# EAGLE design EEPromCap (EAGLE 7.4.0)
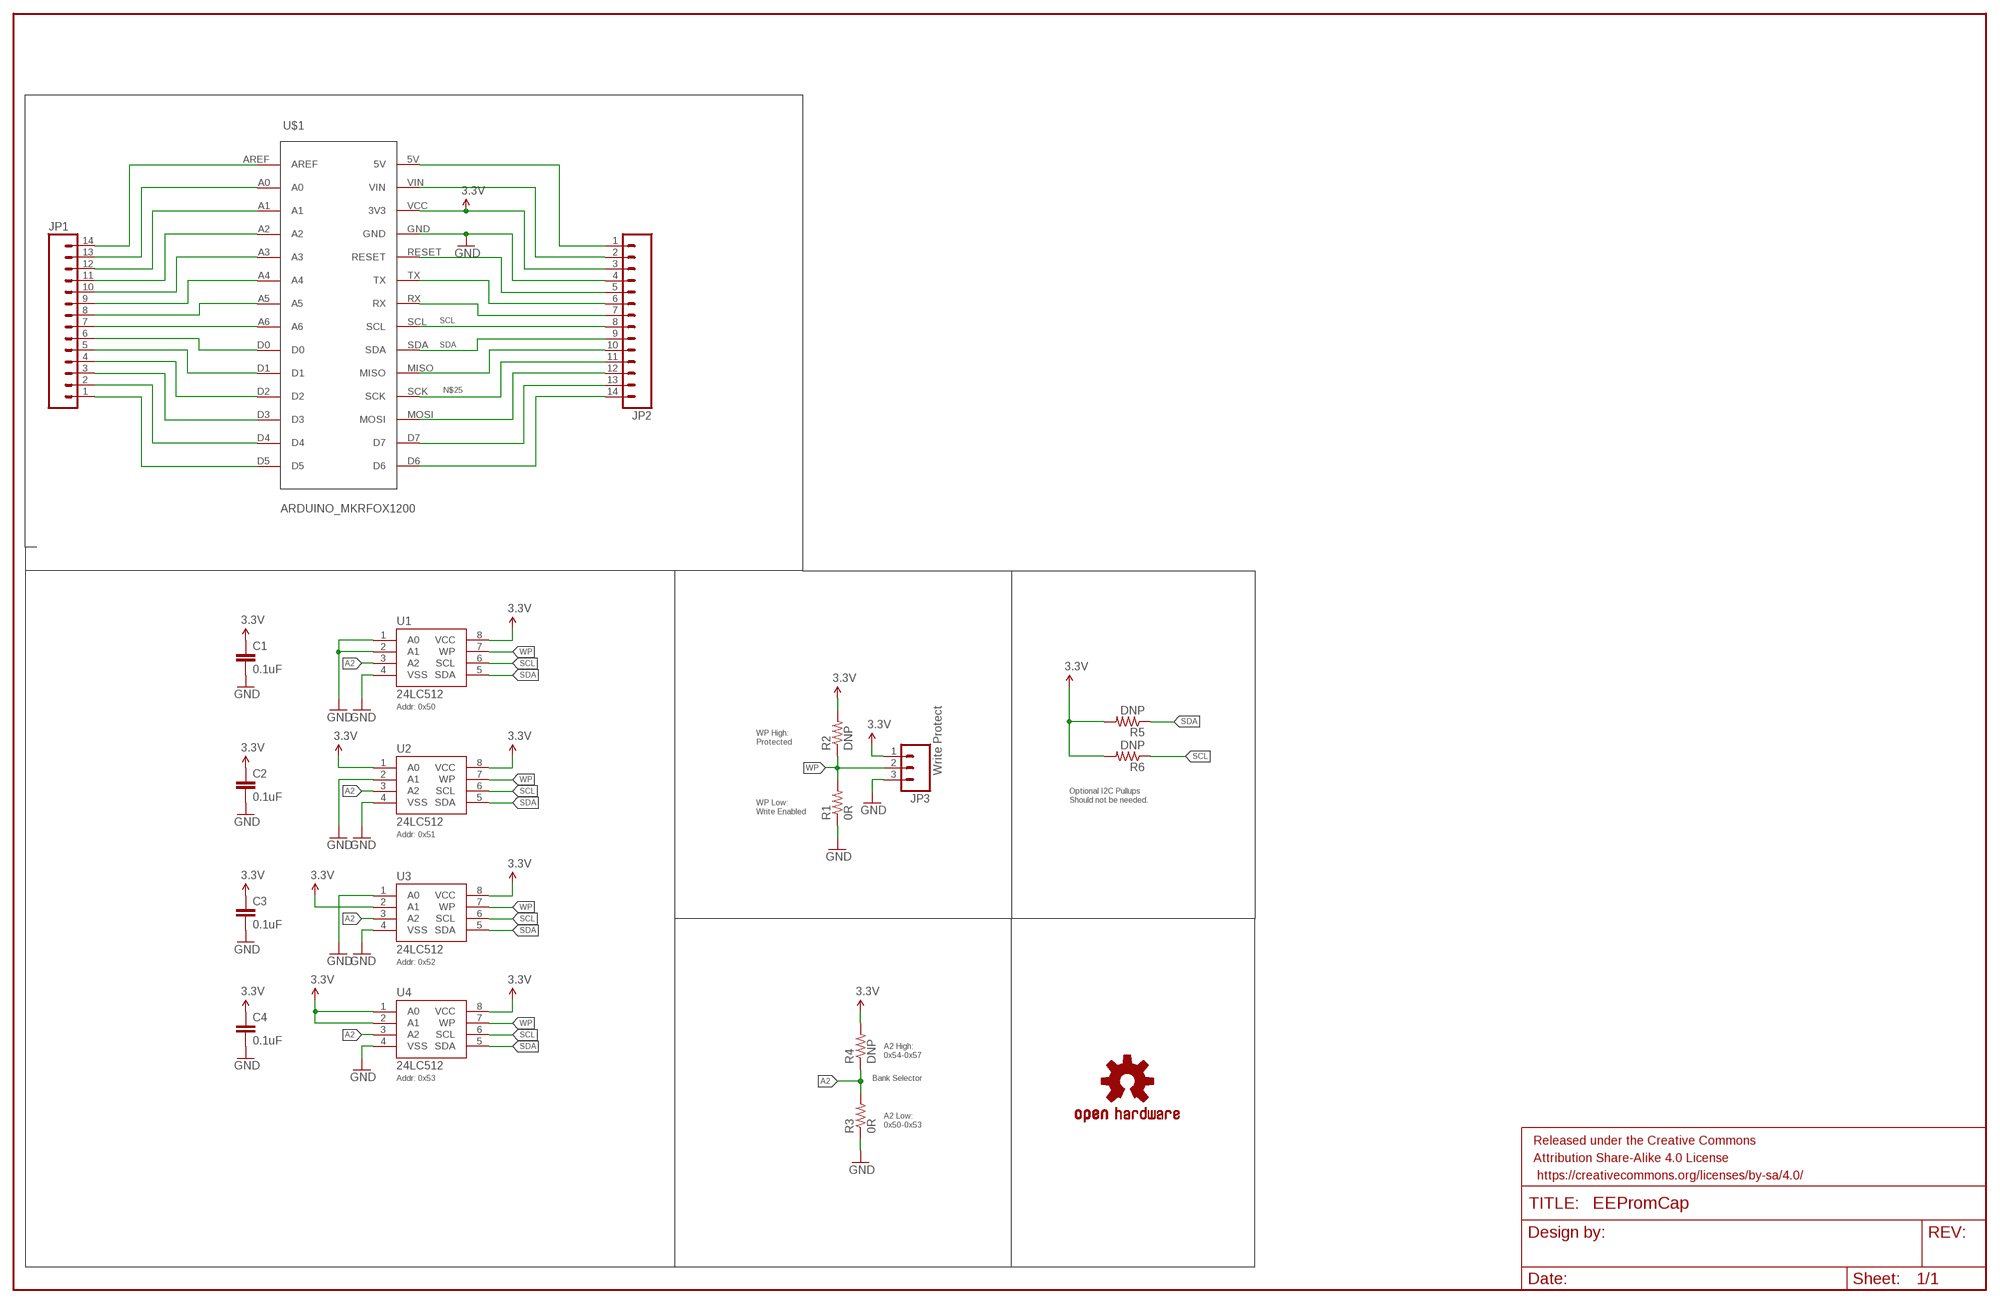
[diagram p0: schematic, sheet 1]

## Parts
C1  0.1uF  CAP1206  [1206]
C2  0.1uF  CAP1206  [1206]
C3  0.1uF  CAP1206  [1206]
C4  0.1uF  CAP1206  [1206]
FRAME1  FRAME-LEDGER  [CREATIVE_COMMONS]
JP1  M14  [1X14]
JP2  M14  [1X14]
JP3  Write Protect  M03PTH  [1X03]
LOGO2  OSHW-LOGOM  [OSHW-LOGO-M]
R1  0R  RESISTOR1206  [1206]
R2  DNP  RESISTOR1206  [1206]
R3  0R  RESISTOR1206  [1206]
R4  DNP  RESISTOR1206  [1206]
R5  DNP  RESISTOR0805-RES  [0805]
R6  DNP  RESISTOR0805-RES  [0805]
U1  24LC512  EEPROM-I2CSMD  [SO08]
U2  24LC512  EEPROM-I2CSMD  [SO08]
U3  24LC512  EEPROM-I2CSMD  [SO08]
U4  24LC512  EEPROM-I2CSMD  [SO08]
U$1  ARDUINO_MKRFOX1200  [ARDUINO_MKRFOX1200]

## Nets
3.3V: C1.1 C2.1 C3.1 C4.1 JP2.3 JP3.1 R2.2 R4.2 R5.2 R6.2 U1.8(VCC) U2.1(A0) U2.8(VCC) U3.2(A1) U3.8(VCC) U4.1(A0) U4.2(A1) U4.8(VCC) U$1.VCC(3V3)
A2: R3.2 R4.1 U1.3(A2) U2.3(A2) U3.3(A2) U4.3(A2)
GND: C1.2 C2.2 C3.2 C4.2 JP2.4 JP3.3 R1.1 R3.1 U1.1(A0) U1.2(A1) U1.4(VSS) U2.2(A1) U2.4(VSS) U3.1(A0) U3.4(VSS) U4.4(VSS) U$1.GND
N$1: JP1.14 U$1.AREF
N$2: JP1.13 U$1.A0
N$3: JP1.12 U$1.A1
N$4: JP1.11 U$1.A2
N$5: JP1.10 U$1.A3
N$6: JP1.9 U$1.A4
N$7: JP1.8 U$1.A5
N$8: JP1.7 U$1.A6
N$9: JP1.6 U$1.D0
N$10: JP1.5 U$1.D1
N$11: JP1.4 U$1.D2
N$12: JP1.3 U$1.D3
N$13: JP1.2 U$1.D4
N$14: JP1.1 U$1.D5
N$15: JP2.1 U$1.5V
N$16: JP2.2 U$1.VIN
N$19: JP2.5 U$1.RESET
N$20: JP2.6 U$1.TX
N$21: JP2.7 U$1.RX
N$24: JP2.10 U$1.MISO
N$25: JP2.11 U$1.SCK
N$26: JP2.12 U$1.MOSI
N$27: JP2.13 U$1.D7
N$28: JP2.14 U$1.D6
SCL: JP2.8 R6.1 U1.6(SCL) U2.6(SCL) U3.6(SCL) U4.6(SCL) U$1.SCL
SDA: JP2.9 R5.1 U1.5(SDA) U2.5(SDA) U3.5(SDA) U4.5(SDA) U$1.SDA
WP: JP3.2 R1.2 R2.1 U1.7(WP) U2.7(WP) U3.7(WP) U4.7(WP)

## Notes on the sheet
- Addr: 0x50
- WP High:
  Protected
- Optional I2C Pullups
  Should not be needed.
- WP Low:
  Write Enabled
- Addr: 0x51
- Addr: 0x52
- A2 High:
  0x54-0x57
- Addr: 0x53 | Bank Selector
- A2 Low:
  0x50-0x53

## Library data of the parts
C1-C4 = SparkFun-Capacitors:CAP: Capacitor Standard 0603 ceramic capacitor, and 0.1" leaded capacitor.
FRAME1 = SparkFun-Aesthetics:FRAME-LEDGER: Schematic Frame Standard 11x14 US Ledger frame
JP1 JP2 = SparkFun-Connectors:M14: Header 14 Standard 14-pin 0.1" header. Use with straight break away headers (SKU : PRT-00116), right angle break away headers (PRT-00553), swiss pins (PRT-00743), machine pins (PRT-00117), and female headers (PRT-00115).
JP3 = SparkFun-Connectors:M03: Header 3 Standard 3-pin 0.1" header. Use with straight break away headers (SKU : PRT-00116), right angle break away headers (PRT-00553), swiss pins (PRT-00743), machine pins (PRT-00117), and female headers (PRT-00115). Molex polarized connector foot print use with SKU : PRT-08232 with associated crimp pins and housings.
LOGO2 = SparkFun-Aesthetics:OSHW-LOGO: Open Source Hardware Logo This logo indicates the piece of hardware it is found on incorporates a OSHW license and/or adheres to the definition of open source hardware found here: http://freedomdefined.org/OSHW
R1-R6 = SparkFun-Resistors:RESISTOR: Resistor Basic schematic elements and footprints for 0603, 1206, and PTH resistors.
U1-U4 = SparkFun-DigitalIC:EEPROM-I2C: I2C EEPROM chips, 24LC256 (and others)
U$1 = Arduino:ARDUINO_MKRFOX1200

## Board
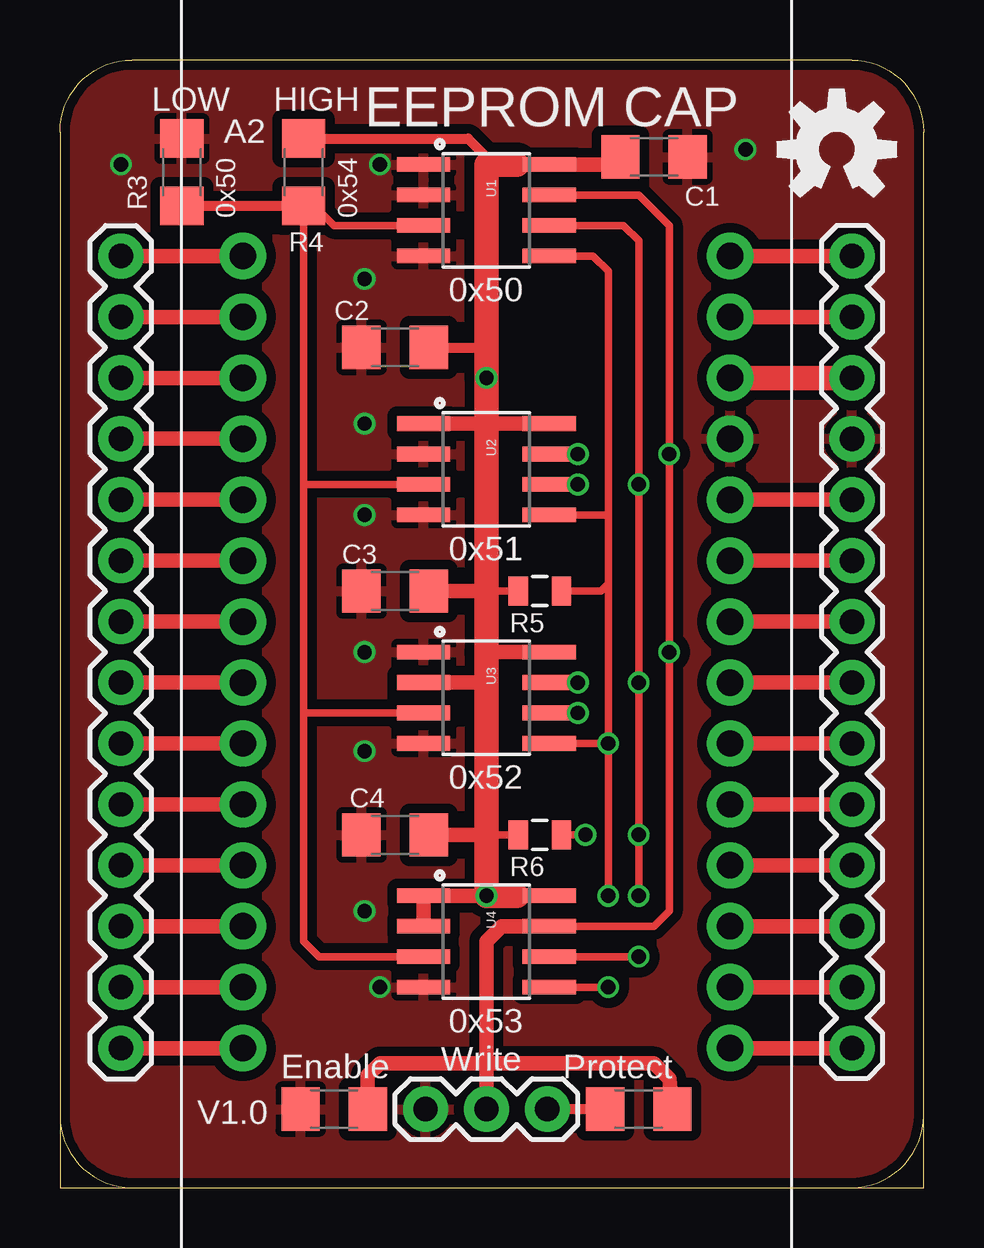
[diagram p1: board, top side]
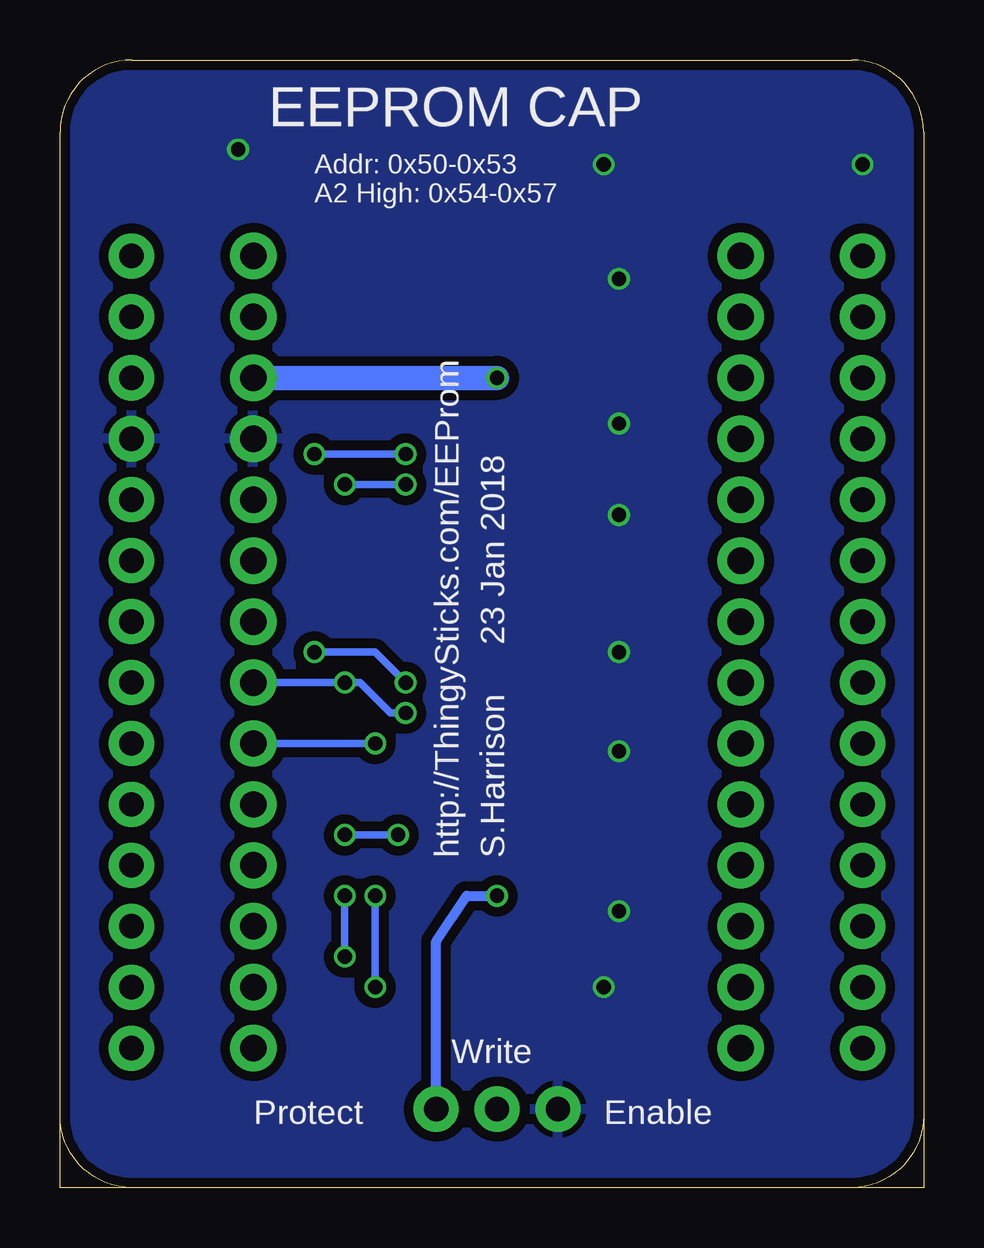
[diagram p2: board, bottom side, seen from below]

Size 36 x 47 mm. Coordinates in mm from the lower left corner, seen from the top.
Outline: 3,0 0,0 0,3
Outline: 3,0 33,0
Outline: 33,0 36,0 36,3
Outline: 36,3 36,44 arc90 33,47 3,47 arc90 0,44 0,3
Outline: 0,3 arc90 3,0
Outline: 33,0 arc90 36,3
Copper layers (1*16): Top 0.035mm / dielectric 1.5mm / Bottom 0.035mm
Design rules "dirt_cheap_dirty_boards.v1": minimum track width 5mil, minimum drill 12mil, track to track 5mil, track to pad 5mil, pad to pad 5mil, via to via 5mil, smd to smd 0mil, copper to edge 10mil, drill to drill 10mil, minimum pad ring 10mil, minimum via ring 6mil, stop-mask expansion 2mil, vias tented up to drill 25mil, thermal gap 10mil

### Footprints (pad centres in the part's own frame; a part is rotated, then mirrored left to right if it is on the bottom)
1206 = smd 1.6 x 1.8: 1 -1.4,0; 2 1.4,0
1X14 = drill 1.016 pad 1.88: 1 0,0; 2 2.54,0; 3 5.08,0; 4 7.62,0; 5 10.16,0; 6 12.7,0; 7 15.24,0; 8 17.78,0; 9 20.32,0; 10 22.86,0; 11 25.4,0; 12 27.94,0; 13 30.48,0; 14 33.02,0
1X03 = drill 1.016 pad 1.88: 1 0,0; 2 2.54,0; 3 5.08,0
0805 = smd 0.8 x 1.2: 1 -0.9,0; 2 0.9,0
SO08 = smd 0.61 x 2.21: 1 -1.905,-2.616; 2 -0.635,-2.616; 3 0.635,-2.616; 4 1.905,-2.616; 5 1.905,2.616; 6 0.635,2.616; 7 -0.635,2.616; 8 -1.905,2.616
ARDUINO_MKRFOX1200 = drill 1.1 pad 1.93: 5V 22.86,45.72; A0 2.54,43.18; A1 2.54,40.64; A2 2.54,38.1; A3 2.54,35.56; A4 2.54,33.02; A5 2.54,30.48; A6 2.54,27.94; AREF 2.54,45.72; D0 2.54,25.4; D1 2.54,22.86; D2 2.54,20.32; D3 2.54,17.78; D4 2.54,15.24; D5 2.54,12.7; D6 22.86,12.7; D7 22.86,15.24; GND 22.86,38.1; MISO 22.86,22.86; MOSI 22.86,17.78; RESET 22.86,35.56; RX 22.86,30.48; SCK 22.86,20.32; SCL 22.86,27.94; SDA 22.86,25.4; TX 22.86,33.02; VCC 22.86,40.64; VIN 22.86,43.18

### Placement (x,y rotation side)
C1  24.77,42.96 0 top
C2  13.97,35.02 180 top
C3  13.97,24.86 180 top
C4  13.97,14.7 180 top
FRAME1  -9.53,-88.81 0 top  (outside the outline)
JP1  2.54,5.81 90 top
JP2  33.02,38.83 270 top
JP3  20.32,3.27 180 top
LOGO2  32.38,43.27 0 top
R1  11.43,3.27 0 top
R2  24.13,3.27 180 top
R3  5.08,42.32 270 top
R4  10.16,42.32 90 top
R5  20,24.86 180 top
R6  20,14.7 180 top
U1  17.78,40.73 270 top
U2  17.78,29.94 270 top
U3  17.78,20.41 270 top
U4  17.78,10.26 270 top
U$1  5.08,-6.89 0 top

### Tracks (layer width: path | path; a pad name or v marks a point on that pad's centre or on a via)
3.3V  (via drill 0.6)
  Top 0.305: R6.2 17.78,14.7 | R5.2 18.1,24.86 17.78,24.54
  Top 0.406: R4.2 17.02,43.72 17.78,42.96 17.78,42.64 | C2.1 17.78,35.02 | R2.2 JP3.1
  Top 0.61: 19.05,42.64 U1.8 22.73,42.64 C1.1 | 19.05,12.16 U4.8 | U2.8 17.78,31.84 U2.1 | U3.8 17.78,22.32 | C3.1 17.78,24.86 | U3.2 17.78,21.05 | C4.1 17.78,14.7 | v17.78,12.16 U4.1 U4.2
  Top 1.016: JP2.3 U$1.VCC | 19.05,42.64 17.78,42.64 17.78,35.02 v17.78,33.75 17.78,31.84 17.78,24.86 17.78,24.54 17.78,22.32 17.78,21.05 17.78,14.7 v17.78,12.16 19.05,12.16
  Bottom 0.406: JP3.1 20.32,10.26 19.05,12.16 v17.78,12.16
  Bottom 1.016: U$1.VCC v17.78,33.75
A2
  Top 0.305: 10.16,41.37 11.43,40.1 U1.3 | U4.3 10.79,9.62 10.16,10.26 10.16,19.78 | 10.16,19.78 10.16,29.3 | 10.16,29.3 R4.1 | U2.3 10.16,29.3 | U3.3 10.16,19.78
  Top 0.406: R3.2 R4.1 10.16,41.37
GND  (via drill 0.6)
  other vias: 13.34,8.35 12.7,18.19 12.7,22.32 12.7,28.04 12.7,11.53 12.7,31.84 12.7,37.88 13.34,42.64 2.54,42.64 28.57,43.27
  pour Bottom (isolate 0.406, rank 6): -0.3,-0.4 -0.5,47.59 36.3,47.38 36.3,-0.4
  pour Top (isolate 0.406, rank 5): 0,47.09 36.2,47.09 36.2,0.09 0,0.09
N$1
  Top 0.61: JP1.14 U$1.AREF
N$2
  Top 0.61: U$1.A0 JP1.13
N$3
  Top 0.61: JP1.12 U$1.A1
N$4
  Top 0.61: JP1.11 U$1.A2
N$5
  Top 0.61: U$1.A3 JP1.10
N$6
  Top 0.61: JP1.9 U$1.A4
N$7
  Top 0.61: JP1.8 U$1.A5
N$8
  Top 0.61: JP1.7 U$1.A6
N$9
  Top 0.61: U$1.D0 JP1.6
N$10
  Top 0.61: JP1.5 U$1.D1
N$11
  Top 0.61: JP1.4 U$1.D2
N$12
  Top 0.61: JP1.3 U$1.D3
N$13
  Top 0.61: JP1.2 U$1.D4
N$14
  Top 0.61: JP1.1 U$1.D5
N$15
  Top 0.61: U$1.5V JP2.1
N$16
  Top 0.61: U$1.VIN JP2.2
N$19
  Top 0.61: U$1.RESET JP2.5
N$20
  Top 0.61: U$1.TX JP2.6
N$21
  Top 0.61: U$1.RX JP2.7
N$24
  Top 0.61: U$1.MISO JP2.10
N$25
  Top 0.61: JP2.11 U$1.SCK
N$26
  Top 0.61: U$1.MOSI JP2.12
N$27
  Top 0.61: JP2.13 U$1.D7
N$28
  Top 0.61: U$1.D6 JP2.14
SCL  (via drill 0.6)
  Top 0.305: U1.6 23.5,40.1 24.13,39.47 v24.13,29.3 v24.13,21.05 v24.13,14.7 v24.13,12.16 | v24.13,9.62 U4.6 | U2.6 v21.59,29.3 | R6.1 v21.91,14.7
  Top 0.406: v21.59,19.78 U3.6
  Top 0.61: U$1.SCL JP2.8
  Bottom 0.305: v24.13,12.16 v24.13,9.62 | U$1.SCL v24.13,21.05 23.5,21.05 22.23,19.78 v21.59,19.78 | v21.59,29.3 v24.13,29.3 | v21.91,14.7 v24.13,14.7
SDA  (via drill 0.6)
  Top 0.305: U1.5 22.23,38.83 22.86,38.2 22.86,28.04 | 22.86,28.04 22.86,25.18 | 22.86,25.18 v22.86,18.51 | v22.86,18.51 v22.86,12.16 | v22.86,8.35 U4.5 | U3.5 v22.86,18.51 | U2.5 22.86,28.04 | R5.1 22.54,24.86 22.86,25.18
  Top 0.61: U$1.SDA JP2.9
  Bottom 0.305: v22.86,12.16 v22.86,8.35 | U$1.SDA v22.86,18.51
WP  (via drill 0.6)
  Top 0.305: U1.7 24.13,41.37 25.4,40.1 v25.4,30.57 v25.4,22.32 25.4,11.53 24.77,10.89 U4.7 | U3.7 v21.59,21.05
  Top 0.406: U2.7 v21.59,30.57
  Top 0.61: R2.1 25.4,4.54 24.77,5.17 17.78,5.17 | U4.7 18.41,10.89 17.78,10.26 17.78,5.17 | JP3.2 17.78,5.17 | R1.2 12.83,4.67 13.34,5.17 17.78,5.17
  Bottom 0.305: v21.59,30.57 v25.4,30.57 | v21.59,21.05 22.86,22.32 v25.4,22.32

### Text on the board
tNames: LOW | A2 | HIGH | EEPROM CAP | 0x50 | 0x54 | 0x50 | 0x51 | 0x52 | 0x53 | Enable | Write | Protect | V1.0
bNames: EEPROM CAP | Addr: 0x50-0x53 / A2 High: 0x54-0x57 | 23 Jan 2018 | S.Harrison | http://ThingySticks.com/EEProm | Write | Enable | Protect